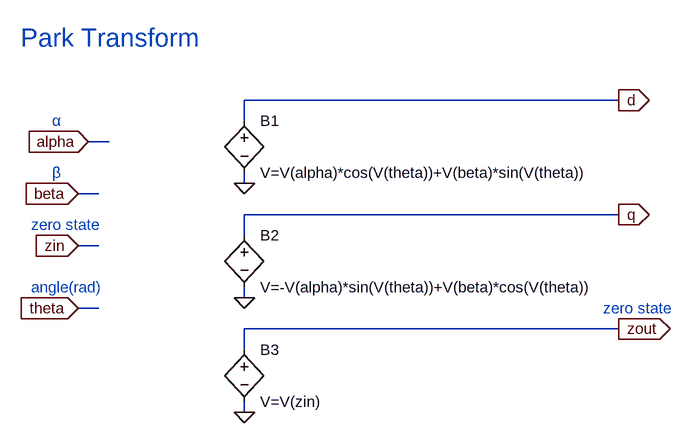
[diagram p0: schematic PARK.asc]
PARK.asc, the LTspice schematic file:
Version 4
SHEET 1 880 680
WIRE 592 96 16 96
WIRE 16 128 16 96
WIRE -192 160 -224 160
WIRE 16 224 16 208
WIRE -208 240 -240 240
WIRE 592 272 16 272
WIRE 16 304 16 272
WIRE -208 320 -240 320
WIRE 16 400 16 384
WIRE -208 416 -240 416
WIRE 592 448 16 448
WIRE 16 480 16 448
WIRE 16 576 16 560
FLAG 16 224 0
FLAG 592 96 d
IOPIN 592 96 Out
FLAG -224 160 alpha
IOPIN -224 160 In
FLAG -240 320 zin
IOPIN -240 320 In
FLAG 16 400 0
FLAG 592 272 q
IOPIN 592 272 Out
FLAG 16 576 0
FLAG 592 448 zout
IOPIN 592 448 Out
FLAG -240 416 theta
IOPIN -240 416 In
FLAG -240 240 beta
IOPIN -240 240 In
SYMBOL bv 16 112 R0
SYMATTR InstName B1
SYMATTR Value V=V(alpha)*cos(V(theta))+V(beta)*sin(V(theta))
SYMBOL bv 16 288 R0
SYMATTR InstName B2
SYMATTR Value V=-V(alpha)*sin(V(theta))+V(beta)*cos(V(theta))
SYMBOL bv 16 464 R0
SYMATTR InstName B3
SYMATTR Value V=V(zin)
TEXT -328 0 Left 4 ;Park Transform
TEXT -280 128 Left 2 ;α
TEXT -280 208 Left 2 ;β
TEXT -312 288 Left 2 ;zero state
TEXT -312 384 Left 2 ;angle(rad)
TEXT 568 416 Left 2 ;zero state

The netlist it stands for:
* PARK.asc
B1 d 0 V=V(alpha)*cos(V(theta))+V(beta)*sin(V(theta))
B2 q 0 V=-V(alpha)*sin(V(theta))+V(beta)*cos(V(theta))
B3 zout 0 V=V(zin)
* Park Transform
* α
* β
* zero state
* angle(rad)
* zero state
.backanno
.end